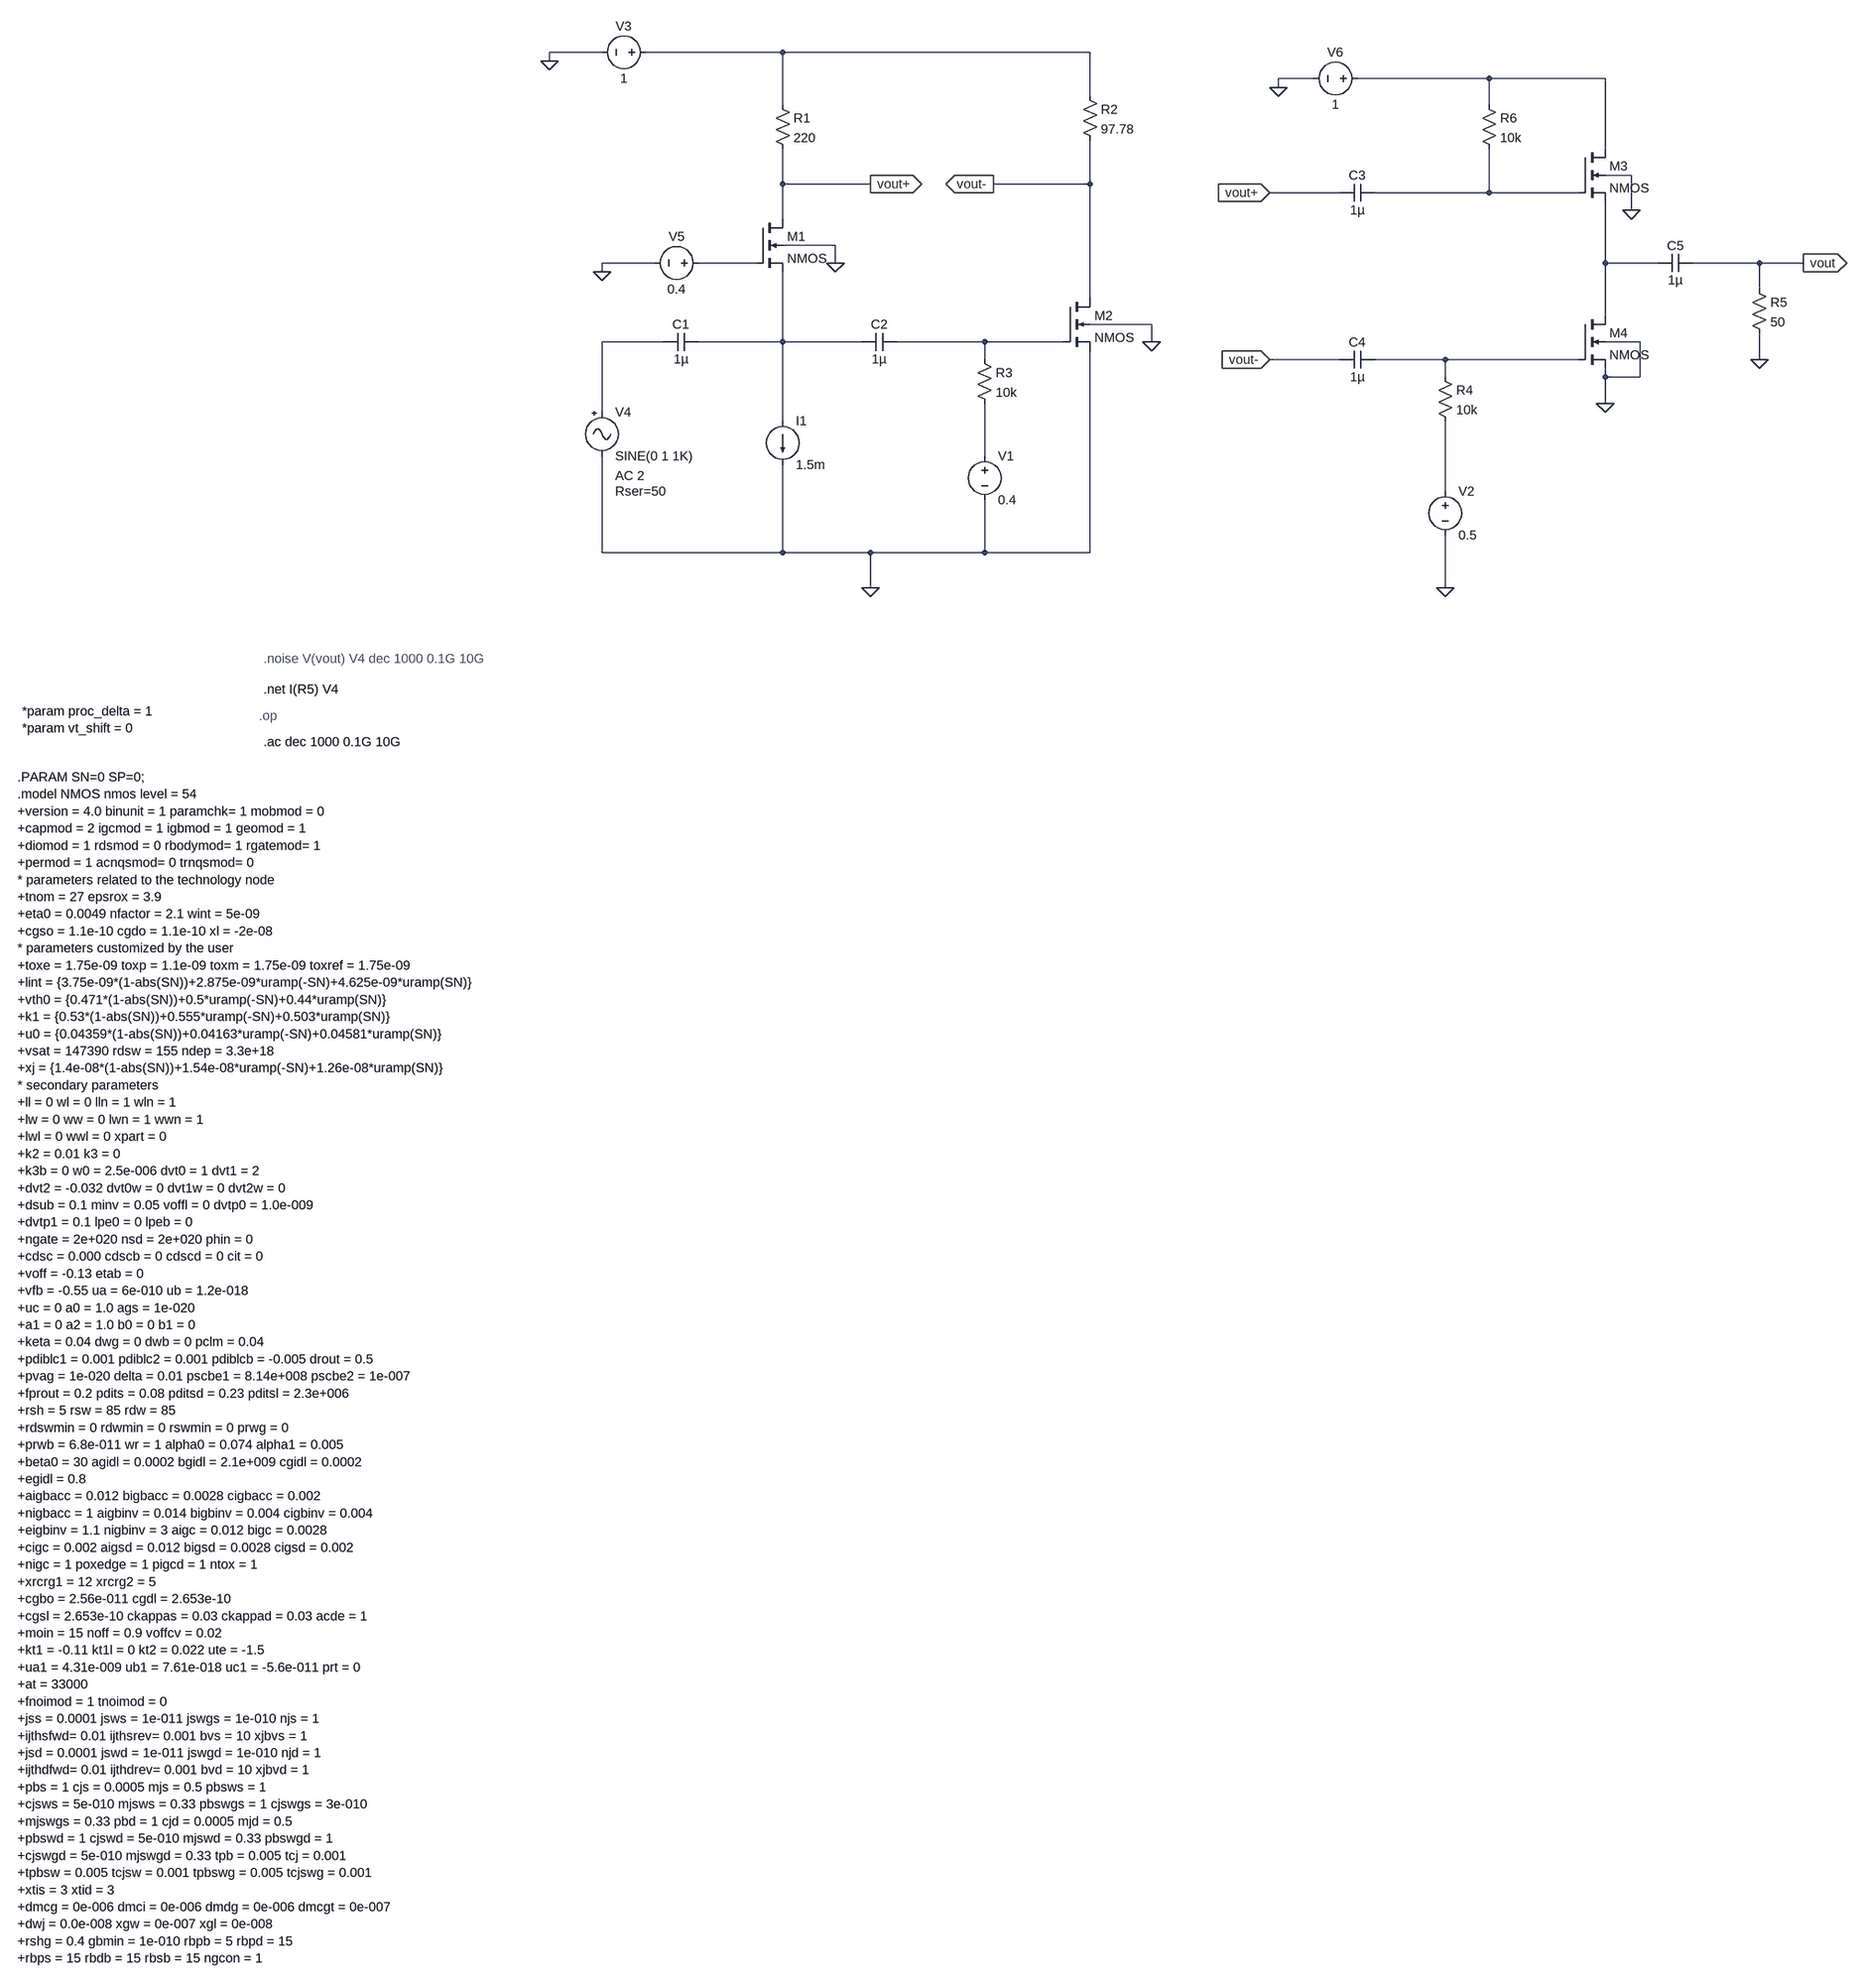
[diagram p0: schematic Circuit_L45nm_n_225.asc]
Circuit_L45nm_n_225.asc, the LTspice schematic file:
Version 4
SHEET 1 2732 3580
WIRE -224 -80 -320 -80
WIRE 112 -80 -144 -80
WIRE 672 -80 112 -80
WIRE -320 -64 -320 -80
WIRE 1296 -32 1232 -32
WIRE 1616 -32 1376 -32
WIRE 1984 -32 1616 -32
WIRE 1232 -16 1232 -32
WIRE 672 0 672 -80
WIRE 112 16 112 -80
WIRE 1616 16 1616 -32
WIRE 1984 96 1984 -32
WIRE 2032 144 1984 144
WIRE 112 160 112 96
WIRE 272 160 112 160
WIRE 672 160 672 80
WIRE 672 160 496 160
WIRE 1344 176 1216 176
WIRE 1616 176 1616 96
WIRE 1616 176 1408 176
WIRE 1936 176 1616 176
WIRE 2032 208 2032 144
WIRE 112 224 112 160
WIRE 208 272 112 272
WIRE -128 304 -224 304
WIRE 64 304 -48 304
WIRE 208 304 208 272
WIRE 1984 304 1984 192
WIRE 2080 304 1984 304
WIRE 2320 304 2144 304
WIRE 2400 304 2320 304
WIRE -224 320 -224 304
WIRE 2320 352 2320 304
WIRE 672 368 672 160
WIRE 1984 400 1984 304
WIRE 784 416 672 416
WIRE -112 448 -224 448
WIRE 112 448 112 320
WIRE 112 448 -48 448
WIRE 256 448 112 448
WIRE 480 448 320 448
WIRE 624 448 480 448
WIRE 784 448 784 416
WIRE 2048 448 1984 448
WIRE 480 480 480 448
WIRE 1344 480 1216 480
WIRE 1536 480 1408 480
WIRE 1936 480 1536 480
WIRE 2320 480 2320 432
WIRE 1536 512 1536 480
WIRE 1984 512 1984 496
WIRE 2048 512 2048 448
WIRE 2048 512 1984 512
WIRE 1984 560 1984 512
WIRE -224 576 -224 448
WIRE 112 592 112 448
WIRE 480 656 480 560
WIRE 1536 720 1536 592
WIRE -224 832 -224 656
WIRE 112 832 112 672
WIRE 112 832 -224 832
WIRE 272 832 112 832
WIRE 480 832 480 736
WIRE 480 832 272 832
WIRE 672 832 672 464
WIRE 672 832 480 832
WIRE 272 896 272 832
WIRE 1536 896 1536 800
FLAG -320 -64 0
FLAG -224 320 0
FLAG 272 896 0
FLAG 208 304 0
FLAG 784 448 0
FLAG 272 160 vout+
IOPIN 272 160 Out
FLAG 496 160 vout-
IOPIN 496 160 Out
FLAG 1536 896 0
FLAG 1984 560 0
FLAG 2320 480 0
FLAG 1216 176 vout+
IOPIN 1216 176 In
FLAG 1216 480 vout-
IOPIN 1216 480 In
FLAG 2032 208 0
FLAG 1232 -16 0
FLAG 2400 304 vout
IOPIN 2400 304 Out
SYMBOL res 96 0 R0
SYMATTR InstName R1
SYMATTR Value 220
SYMBOL res 656 -16 R0
SYMATTR InstName R2
SYMATTR Value 97.78
SYMBOL cap -48 432 R90
WINDOW 0 0 32 VBottom 2
WINDOW 3 32 32 VTop 2
SYMATTR InstName C1
SYMATTR Value 1µ
SYMBOL voltage 480 640 R0
WINDOW 123 0 0 Left 0
WINDOW 39 0 0 Left 0
SYMATTR InstName V1
SYMATTR Value 0.4
SYMBOL voltage -128 -80 R90
WINDOW 0 -32 56 VBottom 2
WINDOW 3 32 56 VTop 2
WINDOW 123 0 0 Left 0
WINDOW 39 0 0 Left 0
SYMATTR InstName V3
SYMATTR Value 1
SYMBOL Misc\\signal -224 560 R0
WINDOW 123 24 132 Left 2
WINDOW 39 24 160 Left 2
SYMATTR Value2 AC 2
SYMATTR SpiceLine Rser=50
SYMATTR InstName V4
SYMBOL current 112 592 R0
WINDOW 123 0 0 Left 0
WINDOW 39 0 0 Left 0
SYMATTR InstName I1
SYMATTR Value 1.5m
SYMBOL voltage -32 304 R90
WINDOW 0 -32 56 VBottom 2
WINDOW 3 32 56 VTop 2
WINDOW 123 0 0 Left 0
WINDOW 39 0 0 Left 0
SYMATTR InstName V5
SYMATTR Value 0.4
SYMBOL nmos4 64 224 R0
SYMATTR InstName M1
SYMATTR Value2 l=45n w=13u
SYMBOL nmos4 624 368 R0
SYMATTR InstName M2
SYMATTR Value2 l=45n w=48u
SYMBOL cap 320 432 R90
WINDOW 0 0 32 VBottom 2
WINDOW 3 32 32 VTop 2
SYMATTR InstName C2
SYMATTR Value 1µ
SYMBOL res 464 464 R0
SYMATTR InstName R3
SYMATTR Value 10k
SYMBOL cap 1408 160 R90
WINDOW 0 0 32 VBottom 2
WINDOW 3 32 32 VTop 2
SYMATTR InstName C3
SYMATTR Value 1µ
SYMBOL cap 1408 464 R90
WINDOW 0 0 32 VBottom 2
WINDOW 3 32 32 VTop 2
SYMATTR InstName C4
SYMATTR Value 1µ
SYMBOL res 1520 496 R0
SYMATTR InstName R4
SYMATTR Value 10k
SYMBOL res 2304 336 R0
SYMATTR InstName R5
SYMATTR Value 50
SYMBOL res 1600 0 R0
SYMATTR InstName R6
SYMATTR Value 10k
SYMBOL nmos4 1936 96 R0
SYMATTR InstName M3
SYMATTR Value2 l=45n w=15u
SYMBOL nmos4 1936 400 R0
SYMATTR InstName M4
SYMATTR Value2 l=45n w=15u
SYMBOL voltage 1536 704 R0
WINDOW 123 0 0 Left 0
WINDOW 39 0 0 Left 0
SYMATTR InstName V2
SYMATTR Value 0.5
SYMBOL cap 2144 288 R90
WINDOW 0 0 32 VBottom 2
WINDOW 3 32 32 VTop 2
SYMATTR InstName C5
SYMATTR Value 1µ
SYMBOL voltage 1392 -32 R90
WINDOW 0 -32 56 VBottom 2
WINDOW 3 32 56 VTop 2
WINDOW 123 0 0 Left 0
WINDOW 39 0 0 Left 0
SYMATTR InstName V6
SYMATTR Value 1
TEXT -1144 1384 Left 2 ;.op
TEXT -1576 1376 Left 2 !*param proc_delta = 1\n*param vt_shift = 0
TEXT -1136 1432 Left 2 !.ac dec 1000 0.1G 10G
TEXT -1136 1336 Left 2 !.net I(R5) V4
TEXT -1136 1280 Left 2 ;.noise V(vout) V4 dec 1000 0.1G 10G
TEXT -1584 1496 Left 2 !.PARAM SN=0 SP=0; \n.model NMOS nmos level = 54\n+version = 4.0 binunit = 1 paramchk= 1 mobmod = 0\n+capmod = 2 igcmod = 1 igbmod = 1 geomod = 1\n+diomod = 1 rdsmod = 0 rbodymod= 1 rgatemod= 1\n+permod = 1 acnqsmod= 0 trnqsmod= 0\n* parameters related to the technology node\n+tnom = 27 epsrox = 3.9\n+eta0 = 0.0049 nfactor = 2.1 wint = 5e-09\n+cgso = 1.1e-10 cgdo = 1.1e-10 xl = -2e-08\n* parameters customized by the user\n+toxe = 1.75e-09 toxp = 1.1e-09 toxm = 1.75e-09 toxref = 1.75e-09\n+lint = {3.75e-09*(1-abs(SN))+2.875e-09*uramp(-SN)+4.625e-09*uramp(SN)}\n+vth0 = {0.471*(1-abs(SN))+0.5*uramp(-SN)+0.44*uramp(SN)}\n+k1 = {0.53*(1-abs(SN))+0.555*uramp(-SN)+0.503*uramp(SN)}\n+u0 = {0.04359*(1-abs(SN))+0.04163*uramp(-SN)+0.04581*uramp(SN)}\n+vsat = 147390 rdsw = 155 ndep = 3.3e+18\n+xj = {1.4e-08*(1-abs(SN))+1.54e-08*uramp(-SN)+1.26e-08*uramp(SN)}\n* secondary parameters\n+ll = 0 wl = 0 lln = 1 wln = 1\n+lw = 0 ww = 0 lwn = 1 wwn = 1\n+lwl = 0 wwl = 0 xpart = 0\n+k2 = 0.01 k3 = 0\n+k3b = 0 w0 = 2.5e-006 dvt0 = 1 dvt1 = 2\n+dvt2 = -0.032 dvt0w = 0 dvt1w = 0 dvt2w = 0\n+dsub = 0.1 minv = 0.05 voffl = 0 dvtp0 = 1.0e-009\n+dvtp1 = 0.1 lpe0 = 0 lpeb = 0\n+ngate = 2e+020 nsd = 2e+020 phin = 0\n+cdsc = 0.000 cdscb = 0 cdscd = 0 cit = 0\n+voff = -0.13 etab = 0\n+vfb = -0.55 ua = 6e-010 ub = 1.2e-018\n+uc = 0 a0 = 1.0 ags = 1e-020\n+a1 = 0 a2 = 1.0 b0 = 0 b1 = 0\n+keta = 0.04 dwg = 0 dwb = 0 pclm = 0.04\n+pdiblc1 = 0.001 pdiblc2 = 0.001 pdiblcb = -0.005 drout = 0.5\n+pvag = 1e-020 delta = 0.01 pscbe1 = 8.14e+008 pscbe2 = 1e-007\n+fprout = 0.2 pdits = 0.08 pditsd = 0.23 pditsl = 2.3e+006\n+rsh = 5 rsw = 85 rdw = 85\n+rdswmin = 0 rdwmin = 0 rswmin = 0 prwg = 0\n+prwb = 6.8e-011 wr = 1 alpha0 = 0.074 alpha1 = 0.005\n+beta0 = 30 agidl = 0.0002 bgidl = 2.1e+009 cgidl = 0.0002\n+egidl = 0.8\n+aigbacc = 0.012 bigbacc = 0.0028 cigbacc = 0.002\n+nigbacc = 1 aigbinv = 0.014 bigbinv = 0.004 cigbinv = 0.004\n+eigbinv = 1.1 nigbinv = 3 aigc = 0.012 bigc = 0.0028\n+cigc = 0.002 aigsd = 0.012 bigsd = 0.0028 cigsd = 0.002\n+nigc = 1 poxedge = 1 pigcd = 1 ntox = 1\n+xrcrg1 = 12 xrcrg2 = 5\n+cgbo = 2.56e-011 cgdl = 2.653e-10\n+cgsl = 2.653e-10 ckappas = 0.03 ckappad = 0.03 acde = 1\n+moin = 15 noff = 0.9 voffcv = 0.02\n+kt1 = -0.11 kt1l = 0 kt2 = 0.022 ute = -1.5\n+ua1 = 4.31e-009 ub1 = 7.61e-018 uc1 = -5.6e-011 prt = 0\n+at = 33000\n+fnoimod = 1 tnoimod = 0\n+jss = 0.0001 jsws = 1e-011 jswgs = 1e-010 njs = 1\n+ijthsfwd= 0.01 ijthsrev= 0.001 bvs = 10 xjbvs = 1\n+jsd = 0.0001 jswd = 1e-011 jswgd = 1e-010 njd = 1\n+ijthdfwd= 0.01 ijthdrev= 0.001 bvd = 10 xjbvd = 1\n+pbs = 1 cjs = 0.0005 mjs = 0.5 pbsws = 1\n+cjsws = 5e-010 mjsws = 0.33 pbswgs = 1 cjswgs = 3e-010\n+mjswgs = 0.33 pbd = 1 cjd = 0.0005 mjd = 0.5\n+pbswd = 1 cjswd = 5e-010 mjswd = 0.33 pbswgd = 1\n+cjswgd = 5e-010 mjswgd = 0.33 tpb = 0.005 tcj = 0.001\n+tpbsw = 0.005 tcjsw = 0.001 tpbswg = 0.005 tcjswg = 0.001\n+xtis = 3 xtid = 3\n+dmcg = 0e-006 dmci = 0e-006 dmdg = 0e-006 dmcgt = 0e-007\n+dwj = 0.0e-008 xgw = 0e-007 xgl = 0e-008\n+rshg = 0.4 gbmin = 1e-010 rbpb = 5 rbpd = 15\n+rbps = 15 rbdb = 15 rbsb = 15 ngcon = 1

The netlist it stands for:
* Circuit_L45nm_n_225.asc
R1 N001 vout+ 220
R2 N001 vout- 97.78
C1 N007 N006 1µ
V1 N010 0 0.4
V3 N001 0 1
V4 N006 0 SINE(0 1 1K) AC 2 Rser=50
I1 N007 0 1.5m
V5 N004 0 0.4
M1 vout+ N004 N007 0 NMOS l=45n w=13u
M2 vout- N008 0 0 NMOS l=45n w=48u
C2 N008 N007 1µ
R3 N008 N010 10k
C3 N003 vout+ 1µ
C4 N009 vout- 1µ
R4 N009 N011 10k
R5 vout 0 50
R6 N002 N003 10k
M3 N002 N003 N005 0 NMOS l=45n w=15u
M4 N005 N009 0 0 NMOS l=45n w=15u
V2 N011 0 0.5
C5 vout N005 1µ
V6 N002 0 1
.model NMOS NMOS
.model PMOS PMOS
.lib standard.mos
* .op
*param proc_delta = 1
*param vt_shift = 0
.ac dec 1000 0.1G 10G
.net I(R5) V4
* .noise V(vout) V4 dec 1000 0.1G 10G
.PARAM SN=0 SP=0;
.model NMOS nmos level = 54
+version = 4.0 binunit = 1 paramchk= 1 mobmod = 0
+capmod = 2 igcmod = 1 igbmod = 1 geomod = 1
+diomod = 1 rdsmod = 0 rbodymod= 1 rgatemod= 1
+permod = 1 acnqsmod= 0 trnqsmod= 0
* parameters related to the technology node
+tnom = 27 epsrox = 3.9
+eta0 = 0.0049 nfactor = 2.1 wint = 5e-09
+cgso = 1.1e-10 cgdo = 1.1e-10 xl = -2e-08
* parameters customized by the user
+toxe = 1.75e-09 toxp = 1.1e-09 toxm = 1.75e-09 toxref = 1.75e-09
+lint = {3.75e-09*(1-abs(SN))+2.875e-09*uramp(-SN)+4.625e-09*uramp(SN)}
+vth0 = {0.471*(1-abs(SN))+0.5*uramp(-SN)+0.44*uramp(SN)}
+k1 = {0.53*(1-abs(SN))+0.555*uramp(-SN)+0.503*uramp(SN)}
+u0 = {0.04359*(1-abs(SN))+0.04163*uramp(-SN)+0.04581*uramp(SN)}
+vsat = 147390 rdsw = 155 ndep = 3.3e+18
+xj = {1.4e-08*(1-abs(SN))+1.54e-08*uramp(-SN)+1.26e-08*uramp(SN)}
* secondary parameters
+ll = 0 wl = 0 lln = 1 wln = 1
+lw = 0 ww = 0 lwn = 1 wwn = 1
+lwl = 0 wwl = 0 xpart = 0
+k2 = 0.01 k3 = 0
+k3b = 0 w0 = 2.5e-006 dvt0 = 1 dvt1 = 2
+dvt2 = -0.032 dvt0w = 0 dvt1w = 0 dvt2w = 0
+dsub = 0.1 minv = 0.05 voffl = 0 dvtp0 = 1.0e-009
+dvtp1 = 0.1 lpe0 = 0 lpeb = 0
+ngate = 2e+020 nsd = 2e+020 phin = 0
+cdsc = 0.000 cdscb = 0 cdscd = 0 cit = 0
+voff = -0.13 etab = 0
+vfb = -0.55 ua = 6e-010 ub = 1.2e-018
+uc = 0 a0 = 1.0 ags = 1e-020
+a1 = 0 a2 = 1.0 b0 = 0 b1 = 0
+keta = 0.04 dwg = 0 dwb = 0 pclm = 0.04
+pdiblc1 = 0.001 pdiblc2 = 0.001 pdiblcb = -0.005 drout = 0.5
+pvag = 1e-020 delta = 0.01 pscbe1 = 8.14e+008 pscbe2 = 1e-007
+fprout = 0.2 pdits = 0.08 pditsd = 0.23 pditsl = 2.3e+006
+rsh = 5 rsw = 85 rdw = 85
+rdswmin = 0 rdwmin = 0 rswmin = 0 prwg = 0
+prwb = 6.8e-011 wr = 1 alpha0 = 0.074 alpha1 = 0.005
+beta0 = 30 agidl = 0.0002 bgidl = 2.1e+009 cgidl = 0.0002
+egidl = 0.8
+aigbacc = 0.012 bigbacc = 0.0028 cigbacc = 0.002
+nigbacc = 1 aigbinv = 0.014 bigbinv = 0.004 cigbinv = 0.004
+eigbinv = 1.1 nigbinv = 3 aigc = 0.012 bigc = 0.0028
+cigc = 0.002 aigsd = 0.012 bigsd = 0.0028 cigsd = 0.002
+nigc = 1 poxedge = 1 pigcd = 1 ntox = 1
+xrcrg1 = 12 xrcrg2 = 5
+cgbo = 2.56e-011 cgdl = 2.653e-10
+cgsl = 2.653e-10 ckappas = 0.03 ckappad = 0.03 acde = 1
+moin = 15 noff = 0.9 voffcv = 0.02
+kt1 = -0.11 kt1l = 0 kt2 = 0.022 ute = -1.5
+ua1 = 4.31e-009 ub1 = 7.61e-018 uc1 = -5.6e-011 prt = 0
+at = 33000
+fnoimod = 1 tnoimod = 0
+jss = 0.0001 jsws = 1e-011 jswgs = 1e-010 njs = 1
+ijthsfwd= 0.01 ijthsrev= 0.001 bvs = 10 xjbvs = 1
+jsd = 0.0001 jswd = 1e-011 jswgd = 1e-010 njd = 1
+ijthdfwd= 0.01 ijthdrev= 0.001 bvd = 10 xjbvd = 1
+pbs = 1 cjs = 0.0005 mjs = 0.5 pbsws = 1
+cjsws = 5e-010 mjsws = 0.33 pbswgs = 1 cjswgs = 3e-010
+mjswgs = 0.33 pbd = 1 cjd = 0.0005 mjd = 0.5
+pbswd = 1 cjswd = 5e-010 mjswd = 0.33 pbswgd = 1
+cjswgd = 5e-010 mjswgd = 0.33 tpb = 0.005 tcj = 0.001
+tpbsw = 0.005 tcjsw = 0.001 tpbswg = 0.005 tcjswg = 0.001
+xtis = 3 xtid = 3
+dmcg = 0e-006 dmci = 0e-006 dmdg = 0e-006 dmcgt = 0e-007
+dwj = 0.0e-008 xgw = 0e-007 xgl = 0e-008
+rshg = 0.4 gbmin = 1e-010 rbpb = 5 rbpd = 15
+rbps = 15 rbdb = 15 rbsb = 15 ngcon = 1
.backanno
.end